# Altium schematic sheet TPS612997YBHR_3.6V_lowIQ_1.9A.SchDoc
size A4; DocumentNumber: 12; SheetNumber: 13; SheetTotal: 14
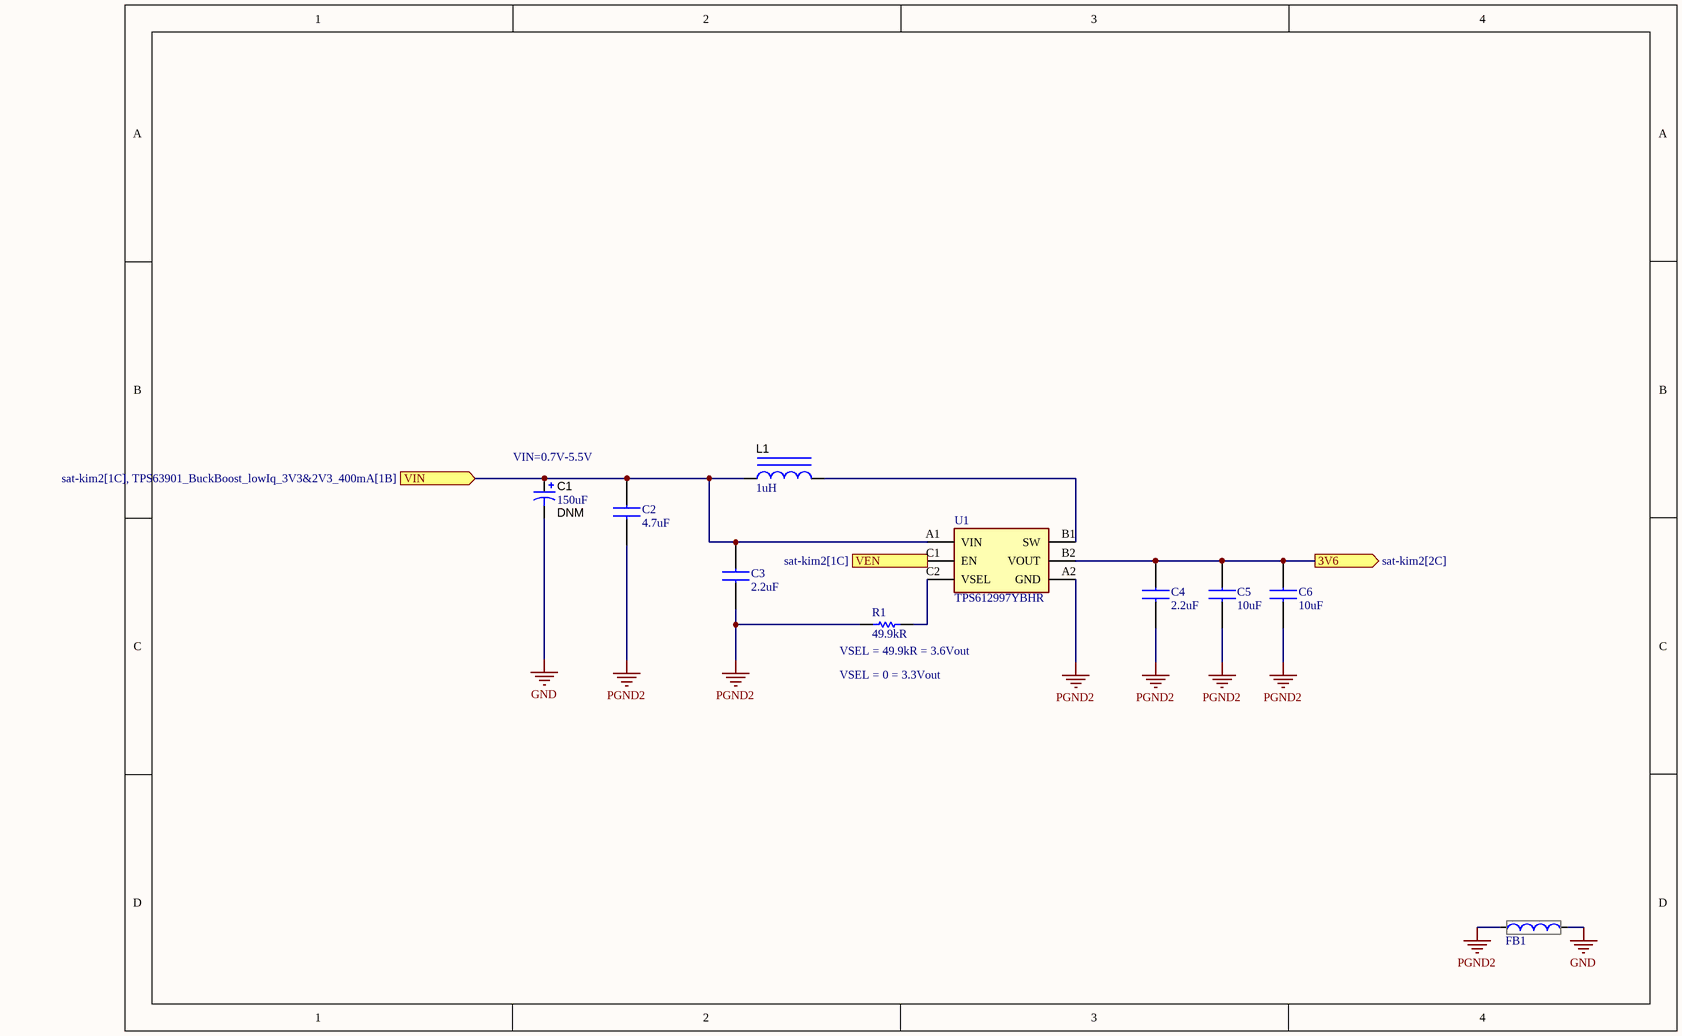
[diagram p0: TPS612997YBHR_3.6V_lowIQ_1.9A.SchDoc]

## Parts
C1  DNM  ValueDisplayed: 150uF  [7343-31]
C2  value 4.7uF  [CAPC1608X90N]  (hidden comment: GRM188Z71A475ME15D)
C3  value 2.2uF  [CAPC1005X70N]  (hidden comment: GRM155R61A225ME95D)
C4  value 2.2uF  [CAPC1005X70N]  (hidden comment: GRM155R61A225ME95D)
C5  value 10uF  [CAPC1005X55N]  (hidden comment: GRM155R61A106ME11D)
C6  value 10uF  [CAPC1005X55N]  (hidden comment: GRM155R61A106ME11D)
FB1  BLM18AG102SN1D  [BLM18SP221SN1B]  (value not drawn)
L1  ValueDisplayed: 1uH  [XEL4020]  (hidden comment: XEL4020-102MEB)
R1  value 49.9kR  [RESC1005X40N]  (hidden comment: CRCW040249K9FKED)
U1  TPS612997YBHR  [BGA6C40P2X3_84X123X40]

## Ports
3V6 (out, see sat-kim2[2C]), VEN (in, see sat-kim2[1C]), VIN (in, see sat-kim2[1C], TPS63901_BuckBoost_lowIq_3V3&2V3_400mA[1B])

## Nets
GND: C1.2(-) FB1.2
PGND2: C2.2 C3.1 C4.1 C5.1 C6.1 FB1.1 R1.2 U1.A2(GND)
3V6: C4.2 C5.2 C6.2 U1.B2(VOUT) ; port 3V6
VEN: U1.C1(EN) ; port VEN
VIN: C1.1(+) C2.1 C3.2 L1.1 U1.A1(VIN) ; port VIN
NetL1_2: L1.2 U1.B1(SW)
NetR1_1: R1.1 U1.C2(VSEL)

## Notes on the sheet
- (near C1) VIN=0.7V-5.5V
- (near R1) VSEL = 49.9kR = 3.6Vout
- (near R1) VSEL = 0 = 3.3Vout
- Title
- Size:
- Date:
- A4
- Reference:
- Time:
- Revision:
- Sheet
- of
- File:

## Library data of the parts
C1 = T495D157K010ATE100: Tantalum Capacitors - Solid SMD 10V 150uF 2917 10% ESR=100mOhms; Manufacturer: Kemet; Polarized: Y; U/M: EA; Cap_F: 150µF; Value1: 0.1 ohm; ESR_ohm: 1d; IRMS_A: 1.225A; TaMin_C: -55°C; TaMax_C: 125°C; AEC Category: Q200; AEC Qualified: N; SizeArea_mm2: 31.39; SizeAreaWB_mm2: 58.59; SizeX_mm: 7.3; SizeY_mm: 4.3; SizeZ_mm: 3.1; CompType: Capacitor; Value: 150uF; PartNumber: T495D157K010ATE100; PackageReference: 7343-31; RoHS: Y; Tolerance_%: 10%; VDC_V: 10V; Value2: 10V; MountType: SMT; Technology: TA; Series: T495; Cap_Case: 7343-31; Publisher: Texas Instruments; LatestRevisionDate: 2017-03-09; LatestRevisionNote: Updated supplier links; ComponentLink1Description: Datasheet link; ComponentLink1URL: http://www.kemet.com/Lists/ProductCatalog/Attachments/261/KEM_T2009_T495.pdf; Supplier 1: Digi-Key; Supplier Part Number 1: 399-8506-1-ND; Supplier 2: Newark; Supplier Part Number 2: 40K0920; Supplier 3: Mouser; Supplier Part Number 3: 80-T495D157K010; AEC Grade: N/A
C2 = GRM188Z71A475ME15D: Multilayer Ceramic Capacitors MLCC - SMD/SMT 4.7 uF 10 VDC 20% 0603 X7R; Manufacturer_Name: Murata Electronics; Manufacturer: Murata; Datasheet Link: http://componentsearchengine.com/Datasheets/1/GRM188Z71A475ME15D.pdf; Height: 0.9mm; Manufacturer_Part_Number: GRM188Z71A475ME15D; Mouser Part Number: 81-GRM188Z71A475ME5D; Mouser Price/Stock: https://www.mouser.co.uk/ProductDetail/Murata-Electronics/GRM188Z71A475ME15D?qs=Ey7%2FXF42M3f7ZZnF1u%2FoMQ%3D%3D; Supplier 1: Digi-Key; Manufacturer Part Number: GRM188Z71A475ME15D; RoHS: Yes; Category: Ceramic Capacitors; Stock 1: 6936; Pricing 1: 1=0,2, 10=0,139, 50=0,0928, 100=0,0789, 500=0,0557, 1000=0,04873 (USD); Case/Package: 0603
C3 C4 = GRM155R61A225ME95D: Multilayer Ceramic Capacitors MLCC - SMD/SMT 2.2 uF 10 VDC 20% 0402 X5R; Manufacturer_Name: Murata Electronics; Datasheet Link: http://www.murata.com/~/media/webrenewal/support/library/catalog/products/capacitor/mlcc/c02e.pdf; Height: 0.7mm; Manufacturer_Part_Number: GRM155R61A225ME95D; Mouser Part Number: 81-GRM155R61A225ME5D; Mouser Price/Stock: https://www.mouser.co.uk/ProductDetail/Murata-Electronics/GRM155R61A225ME95D?qs=eeBpzGFlv%252B9Q12VVb4vywQ%3D%3D; Arrow Part Number: GRM155R61A225ME95D; Arrow Price/Stock: https://www.arrow.com/en/products/grm155r61a225me95d/murata-manufacturing
C5 C6 = GRM155R61A106ME11D: Multilayer Ceramic Capacitors MLCC - SMD/SMT 10 uF 10 VDC 20% 0402 X5R; Manufacturer_Name: Murata Electronics; Datasheet Link: http://www.murata.com/~/media/webrenewal/support/library/catalog/products/capacitor/mlcc/c02e.pdf; Height: 0.55mm; Manufacturer_Part_Number: GRM155R61A106ME11D; Mouser Part Number: 81-GRM155R61A106ME1D; Mouser Price/Stock: https://www.mouser.co.uk/ProductDetail/Murata-Electronics/GRM155R61A106ME11D?qs=xZ%2FP%252Ba9zWqZMJSi57Q8OyA%3D%3D; Arrow Part Number: GRM155R61A106ME11D; Arrow Price/Stock: https://www.arrow.com/en/products/grm155r61a106me11d/murata-manufacturing?region=nac
FB1 = BLM18AG102SN1D: Ferrite Bead - 1000 OHM 25%; Manufacturer_Name: Murata Electronics; Datasheet Link: http://www.murata.com/~/media/webrenewal/support/library/catalog/products/emc/emifil/c31e.ashx?la=en-gb; Height: 0.95mm; Manufacturer_Part_Number: BLM18AG102SN1D; Mouser Part Number: 81-BLM11A102S; Mouser Price/Stock: https://www.mouser.co.uk/ProductDetail/Murata-Electronics/BLM18AG102SN1D?qs=b2kFoOhrN4V4XjRBmusv4w%3D%3D; Arrow Part Number: BLM18AG102SN1D; Arrow Price/Stock: https://www.arrow.com/en/products/blm18ag102sn1d/murata-manufacturing?utm_currency=USD&region=nac
L1 = XEL4020-102MEC: Power Inductors - SMD 1uH Shld 20% 9.6A 14.6mOhms AECQ2; Manufacturer: Coilcraft; Isat: 9A @ 30% inductance drop; Irms: 9.6A @ 40C rise; SizeAreaWB_mm2: 25; DCR_ohm: 0.0133; Value1: 0.0133 ohm; Material: Composite; Imax_A: 9A; SizeZ_mm: 2.1; SizeX_mm: 4; SizeArea_mm2: 16; Ind_H: 1µH; AEC Qualified: Y; AEC Grade: 1; AEC Category: Q200; ComponentLink1URL: http://www.coilcraft.com/pdfs/xel4020.pdf; RoHS: Y; MountType: SMT; Value: 1uH; SizeY_mm: 4; Value2: 9A; CompType: Inductor; PartNumber: XEL4020-102MEB; ComponentLink1Description: Datasheet link; Technology: Shielded
R1 = CRCW040249K9FKED: Thick Film Resistors - SMD 1/16watt 49.9Kohms 1%; Manufacturer_Name: Vishay; Datasheet Link: http://www.vishay.com/docs/20035/dcrcwe3.pdf; Height: 0.4mm; Manufacturer_Part_Number: CRCW040249K9FKED; Mouser Part Number: 71-CRCW0402-49.9K-E3; Mouser Price/Stock: https://www.mouser.co.uk/ProductDetail/Vishay-Dale/CRCW040249K9FKED?qs=hAuyw6LW%252BLhwjtjsHx%2FGDQ%3D%3D; Arrow Part Number: CRCW040249K9FKED; Arrow Price/Stock: https://www.arrow.com/en/products/crcw040249k9fked/vishay?region=nac
U1 = TPS612997YBHR: Switching Voltage Regulators 95-nA low IQ 5.5-V b oost converter with INLIMIT (1.9A); Manufacturer_Name: Texas Instruments; Datasheet Link: https://www.ti.com/lit/gpn/tps61299; Height: 0.4mm; Manufacturer_Part_Number: TPS612997YBHR; Mouser Part Number: 595-TPS612997YBHR; Mouser Price/Stock: https://www.mouser.co.uk/ProductDetail/Texas-Instruments/TPS612997YBHR?qs=mELouGlnn3dLhnQxUdz5hw%3D%3D; Arrow Part Number: TPS612997YBHR; Arrow Price/Stock: https://www.arrow.com/en/products/tps612997ybhr/texas-instruments?utm_currency=USD&region=nac